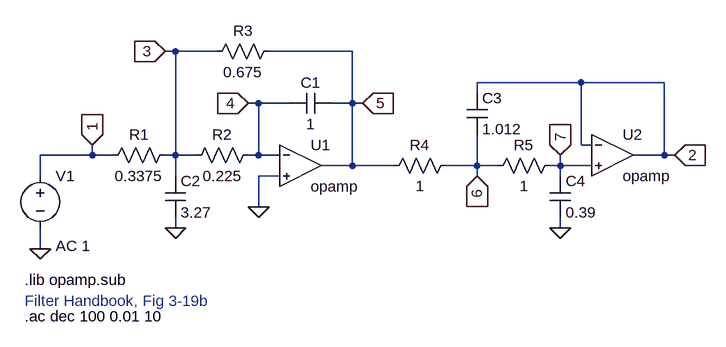
[diagram p0: schematic Active-LP-Filter#1.asc]
Active-LP-Filter#1.asc, the LTspice schematic file:
Version 4
SHEET 1 920 680
WIRE -48 -32 -64 -32
WIRE 16 -32 -48 -32
WIRE 224 -32 96 -32
WIRE 576 16 416 16
WIRE 704 16 576 16
WIRE 416 32 416 16
WIRE 80 48 64 48
WIRE 128 48 80 48
WIRE 224 48 224 -32
WIRE 224 48 192 48
WIRE 240 48 224 48
WIRE 576 112 576 16
WIRE 592 112 576 112
WIRE -176 128 -176 112
WIRE -176 128 -256 128
WIRE -144 128 -176 128
WIRE -48 128 -48 -32
WIRE -48 128 -64 128
WIRE -16 128 -48 128
WIRE 80 128 80 48
WIRE 80 128 64 128
WIRE 112 128 80 128
WIRE 704 128 704 16
WIRE 704 128 656 128
WIRE 720 128 704 128
WIRE 224 144 224 48
WIRE 224 144 176 144
WIRE 288 144 224 144
WIRE 416 144 416 96
WIRE 416 144 368 144
WIRE 448 144 416 144
WIRE 544 144 544 128
WIRE 544 144 528 144
WIRE 592 144 544 144
WIRE -256 160 -256 128
WIRE -48 160 -48 128
WIRE 112 160 80 160
WIRE 416 160 416 144
WIRE 544 160 544 144
WIRE 80 208 80 160
WIRE -48 240 -48 224
WIRE 544 240 544 224
WIRE -256 272 -256 240
FLAG -48 240 0
FLAG 80 208 0
FLAG -176 112 1
IOPIN -176 112 In
FLAG -64 -32 3
IOPIN -64 -32 In
FLAG 240 48 5
IOPIN 240 48 In
FLAG 64 48 4
IOPIN 64 48 In
FLAG 544 240 0
FLAG 416 160 6
IOPIN 416 160 In
FLAG 720 128 2
IOPIN 720 128 In
FLAG 544 128 7
IOPIN 544 128 In
FLAG -256 272 0
SYMBOL OpAmps\\opamp 144 80 R0
SYMATTR InstName U1
SYMBOL res -48 112 R90
WINDOW 0 0 56 VBottom 2
WINDOW 3 32 56 VTop 2
SYMATTR InstName R1
SYMATTR Value 0.3375
SYMBOL res 80 112 R90
WINDOW 0 0 56 VBottom 2
WINDOW 3 32 56 VTop 2
SYMATTR InstName R2
SYMATTR Value 0.225
SYMBOL res 112 -48 R90
WINDOW 0 0 56 VBottom 2
WINDOW 3 32 56 VTop 2
SYMATTR InstName R3
SYMATTR Value 0.675
SYMBOL cap 192 32 R90
WINDOW 0 0 32 VBottom 2
WINDOW 3 32 32 VTop 2
SYMATTR InstName C1
SYMATTR Value 1
SYMBOL cap -64 160 R0
SYMATTR InstName C2
SYMATTR Value 3.27
SYMBOL OpAmps\\opamp 624 64 R0
SYMATTR InstName U2
SYMBOL res 384 128 R90
WINDOW 0 0 56 VBottom 2
WINDOW 3 32 56 VTop 2
SYMATTR InstName R4
SYMATTR Value 1
SYMBOL res 544 128 R90
WINDOW 0 0 56 VBottom 2
WINDOW 3 32 56 VTop 2
SYMATTR InstName R5
SYMATTR Value 1
SYMBOL cap 400 32 R0
SYMATTR InstName C3
SYMATTR Value 1.012
SYMBOL cap 528 160 R0
SYMATTR InstName C4
SYMATTR Value 0.39
SYMBOL voltage -256 144 R0
WINDOW 123 24 124 Left 2
WINDOW 39 0 0 Left 0
SYMATTR Value2 AC 1
SYMATTR InstName V1
SYMATTR Value ""
TEXT -280 320 Left 2 !.lib opamp.sub
TEXT -280 352 Left 2 ;Filter Handbook, Fig 3-19b
TEXT -280 376 Left 2 !.ac dec 100 0.01 10

The netlist it stands for:
* Active-LP-Filter#1.asc
XU1 4 0 5 opamp Aol=100K GBW=10Meg  ; pins invin noninvin out
R1 3 1 0.3375
R2 4 3 0.225
R3 5 3 0.675
C1 5 4 1
C2 3 0 3.27
XU2 2 7 2 opamp Aol=100K GBW=10Meg  ; pins invin noninvin out
R4 6 5 1
R5 7 6 1
C3 2 6 1.012
C4 7 0 0.39
V1 1 0 AC 1
.lib opamp.sub
* Filter Handbook, Fig 3-19b
.ac dec 100 0.01 10
.backanno
.end